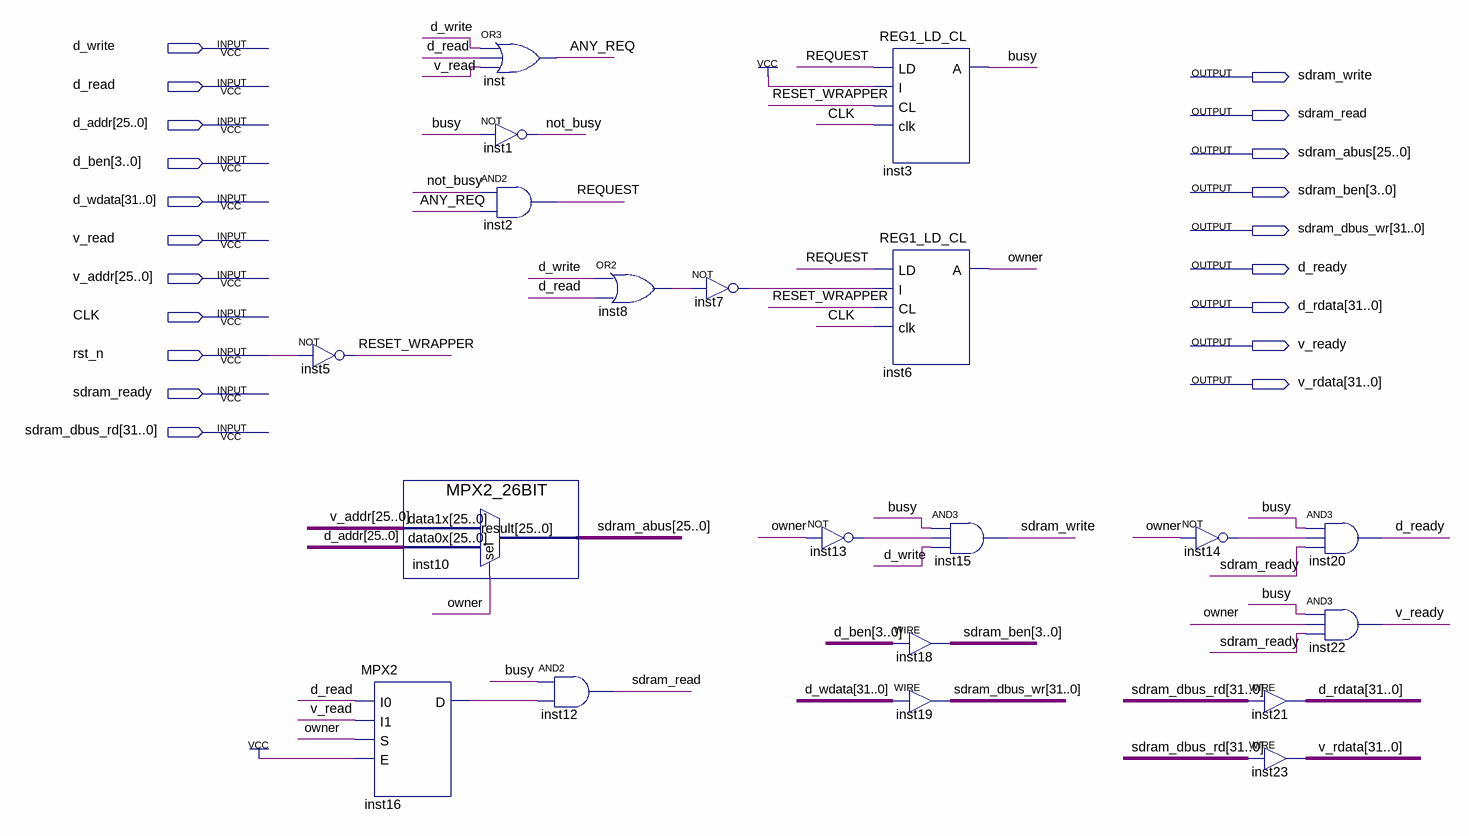
[diagram p0: schematic sheet]
// Quartus schematic sdram_arbiter.bdf as structural Verilog: 20 symbols, 20 pins
module sdram_arbiter (
  input  d_write,
  input  d_read,
  input  [25:0] d_addr,
  input  [3:0] d_ben,
  input  [31:0] d_wdata,
  input  v_read,
  input  [25:0] v_addr,
  input  CLK,
  input  rst_n,
  input  sdram_ready,
  input  [31:0] sdram_dbus_rd,
  output sdram_write,
  output sdram_read,
  output [25:0] sdram_abus,
  output [3:0] sdram_ben,
  output [31:0] sdram_dbus_wr,
  output d_ready,
  output [31:0] d_rdata,
  output v_ready,
  output [31:0] v_rdata
);

  wire ANY_REQ, busy, inst7_out, inst8_out, inst13_out, inst14_out, inst16_d, not_busy, owner, REQUEST,
       RESET_WRAPPER;

  not inst5 (RESET_WRAPPER, rst_n);
  MPX2_26BIT inst10 (.data1x(v_addr), .data0x(d_addr), .sel(owner), .result(sdram_abus));
  MPX2 inst16 (.I0(d_read), .I1(v_read), .S(owner), .E(1'b1), .D(inst16_d));
  or inst (ANY_REQ, d_write, d_read, v_read);
  not inst1 (not_busy, busy);
  and inst2 (REQUEST, not_busy, ANY_REQ);
  and inst12 (sdram_read, busy, inst16_d);
  or inst8 (inst8_out, d_write, d_read);
  not inst7 (inst7_out, inst8_out);
  not inst13 (inst13_out, owner);
  REG1_LD_CL inst3 (.LD(REQUEST), .I(1'b1), .CL(RESET_WRAPPER), .clk(CLK), .A(busy));
  REG1_LD_CL inst6 (.LD(REQUEST), .I(inst7_out), .CL(RESET_WRAPPER), .clk(CLK), .A(owner));
  and inst15 (sdram_write, busy, inst13_out, d_write);
  assign sdram_ben = d_ben;  // WIRE inst18
  assign sdram_dbus_wr = d_wdata;  // WIRE inst19
  not inst14 (inst14_out, owner);
  assign d_rdata = sdram_dbus_rd;  // WIRE inst21
  assign v_rdata = sdram_dbus_rd;  // WIRE inst23
  and inst20 (d_ready, busy, inst14_out, sdram_ready);
  and inst22 (v_ready, busy, owner, sdram_ready);
endmodule
